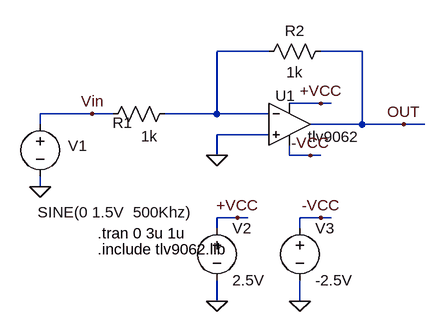
[diagram p0: schematic 16-运放的SR.asc]
16-运放的SR.asc, the LTspice schematic file:
Version 4
SHEET 1 880 680
WIRE 368 -64 288 -64
WIRE 512 -64 448 -64
WIRE 448 16 400 16
WIRE 464 16 448 16
WIRE 96 32 16 32
WIRE 128 32 96 32
WIRE 288 32 288 -64
WIRE 288 32 208 32
WIRE 368 32 288 32
WIRE 16 48 16 32
WIRE 512 48 512 -64
WIRE 512 48 432 48
WIRE 576 48 512 48
WIRE 608 48 576 48
WIRE 368 64 288 64
WIRE 288 96 288 64
WIRE 400 96 400 80
WIRE 432 96 400 96
WIRE 448 96 432 96
WIRE 16 144 16 128
WIRE 320 192 288 192
WIRE 336 192 320 192
WIRE 448 192 416 192
WIRE 464 192 448 192
WIRE 288 208 288 192
WIRE 416 208 416 192
WIRE 288 320 288 288
WIRE 416 320 416 288
FLAG 96 32 Vin
FLAG 16 144 0
FLAG 576 48 OUT
FLAG 448 16 +VCC
FLAG 288 320 0
FLAG 320 192 +VCC
FLAG 416 320 0
FLAG 448 192 -VCC
FLAG 288 96 0
FLAG 432 96 -VCC
SYMBOL res 224 16 R90
WINDOW 0 45 81 VBottom 2
WINDOW 3 35 40 VTop 2
SYMATTR InstName R1
SYMATTR Value 1k
SYMBOL OpAmps\\opamp2 400 -16 R0
WINDOW 3 28 83 Left 2
WINDOW 0 -22 20 Left 2
SYMATTR Value tlv9062
SYMATTR InstName U1
SYMBOL voltage 16 32 R0
WINDOW 123 24 112 Left 2
WINDOW 39 0 0 Left 0
WINDOW 3 -4 151 Left 2
WINDOW 0 43 49 Left 2
SYMATTR Value SINE(0 1.5V  500Khz)
SYMATTR InstName V1
SYMBOL voltage 288 192 R0
WINDOW 123 0 0 Left 0
WINDOW 39 0 0 Left 0
SYMATTR InstName V2
SYMATTR Value 2.5V
SYMBOL voltage 416 192 R0
WINDOW 123 0 0 Left 0
WINDOW 39 0 0 Left 0
SYMATTR InstName V3
SYMATTR Value -2.5V
SYMBOL res 464 -80 R90
WINDOW 0 0 56 VBottom 2
WINDOW 3 32 56 VTop 2
SYMATTR InstName R2
SYMATTR Value 1k
TEXT 104 216 Left 2 !.tran 0 3u 1u
TEXT 104 240 Left 2 !.include tlv9062.lib

The netlist it stands for:
* 16-运放的SR.asc
R1 N001 Vin 1k
XU1 0 N001 +VCC -VCC OUT tlv9062  ; pins In+ In- V+ V- OUT
V1 Vin 0 SINE(0 1.5V  500Khz)
V2 +VCC 0 2.5V
V3 -VCC 0 -2.5V
R2 OUT N001 1k
.tran 0 3u 1u
.include tlv9062.lib
.backanno
.end